# Altium schematic sheet Tlcd-43.SchDoc
size A4
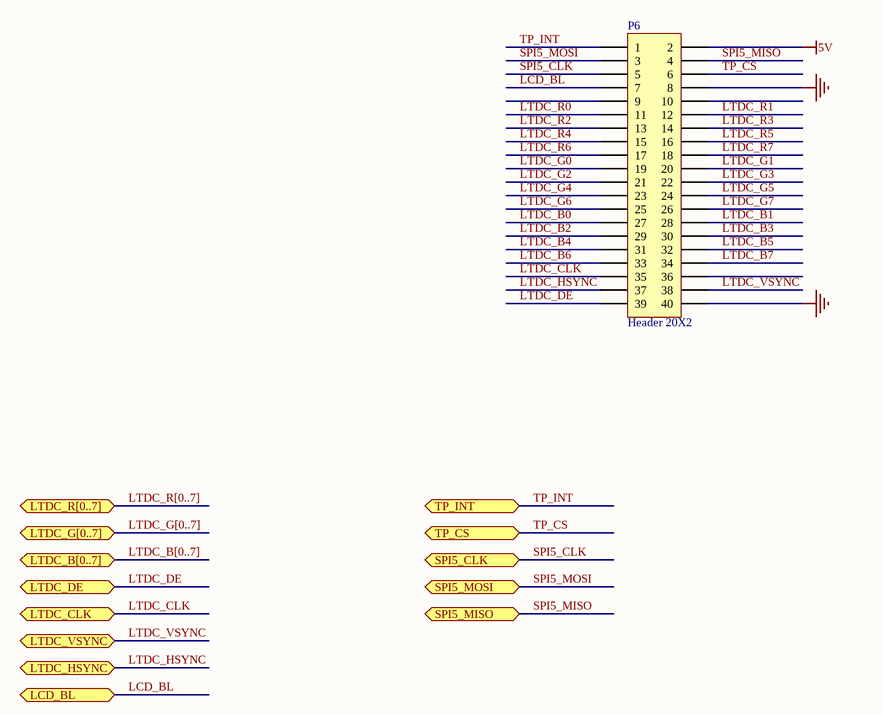
[diagram p0: Tlcd-43.SchDoc]

## Parts
P6  Header 20X2  [HDR2X20]

## Ports
LCD_BL (bidir), LTDC_B[0..7] (bidir), LTDC_CLK (bidir), LTDC_DE (bidir), LTDC_G[0..7] (bidir), LTDC_HSYNC (bidir), LTDC_R[0..7] (bidir), LTDC_VSYNC (bidir), SPI5_CLK (bidir), SPI5_MISO (bidir), SPI5_MOSI (bidir), TP_CS (bidir), TP_INT (bidir)

## Nets
5V: P6.2
DGND: P6.8 P6.40
LCD_BL: P6.7 ; port LCD_BL
LTDC_B0: P6.27
LTDC_B1: P6.28
LTDC_B2: P6.29
LTDC_B3: P6.30
LTDC_B4: P6.31
LTDC_B5: P6.32
LTDC_B6: P6.33
LTDC_B7: P6.34
LTDC_CLK: P6.35 ; port LTDC_CLK
LTDC_DE: P6.39 ; port LTDC_DE
LTDC_G0: P6.19
LTDC_G1: P6.20
LTDC_G2: P6.21
LTDC_G3: P6.22
LTDC_G4: P6.23
LTDC_G5: P6.24
LTDC_G6: P6.25
LTDC_G7: P6.26
LTDC_HSYNC: P6.37 ; port LTDC_HSYNC
LTDC_R0: P6.11
LTDC_R1: P6.12
LTDC_R2: P6.13
LTDC_R3: P6.14
LTDC_R4: P6.15
LTDC_R5: P6.16
LTDC_R6: P6.17
LTDC_R7: P6.18
LTDC_VSYNC: P6.38 ; port LTDC_VSYNC
SPI5_CLK: P6.5 ; port SPI5_CLK
SPI5_MISO: P6.4 ; port SPI5_MISO
SPI5_MOSI: P6.3 ; port SPI5_MOSI
TP_CS: P6.6 ; port TP_CS
TP_INT: P6.1 ; port TP_INT

Not connected (* = marked no-connect by the designer): P6 9 10 36

## Buses and harness runs
bus LTDC_B[0..7] = port LTDC_B[0..7]
bus LTDC_G[0..7] = port LTDC_G[0..7]
bus LTDC_R[0..7] = port LTDC_R[0..7]

## Library data of the parts
P6 = Header 20X2: Header, 20-Pin, Dual row